# EAGLE schematic nano-addon-schematic (EAGLE 9.0.1)
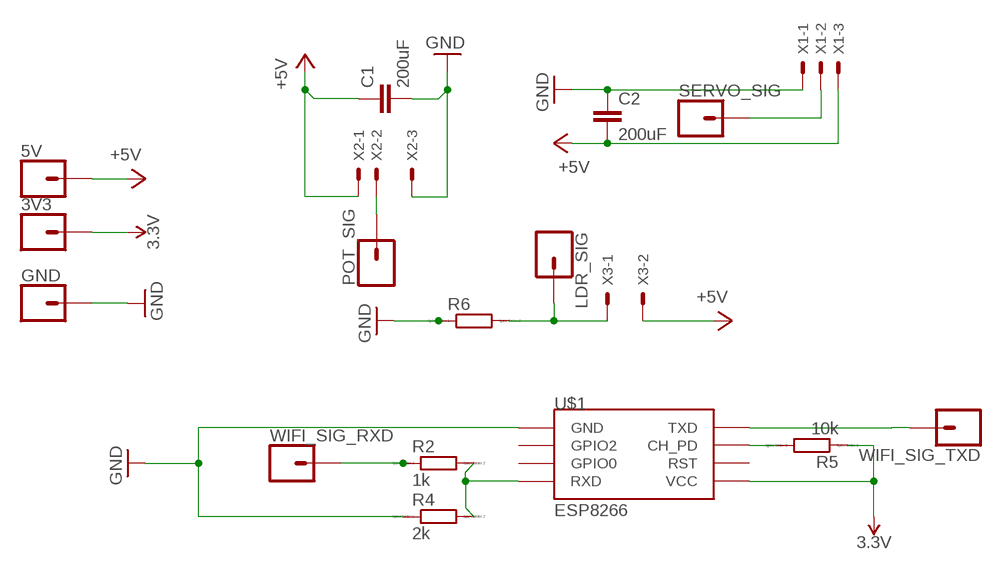
[diagram p0: schematic, sheet 1]

## Parts
3V3  CONN_01  [1X01]
5V  CONN_01  [1X01]
C1  200uF  C-EU050-030X075  [C050-030X075]
C2  200uF  C-EU050-030X075  [C050-030X075]
GND  CONN_01  [1X01]
LDR_SIG  CONN_01  [1X01]
POT_SIG  CONN_01  [1X01]
R2  1k  R0204/7  [0204/7]
R4  2k  R0204/7  [0204/7]
R5  10k  R0204/7  [0204/7]
R6  R0204/7  [0204/7]
SERVO_SIG  CONN_01  [1X01]
U$1  ESP8266  ESP01  [ESP01]
WIFI_SIG_RXD  CONN_01  [1X01]
WIFI_SIG_TXD  CONN_01  [1X01]
X1  KK-156-3  [KK-156-3]
X2  KK-156-3  [KK-156-3]
X3  KK-156-2  [KK-156-2]

## Nets
3.3V: 3V3.1 R5.1 U$1.VCC
+5V: 5V.1 C1.1 C2.2 X1.3 X2.1 X3.2
GND: C1.2 C2.1 GND.1 R4.1 R6.1 U$1.GND X1.1 X2.3
LDR_SIG: LDR_SIG.1 R6.2 X3.1
N$1: POT_SIG.1 X2.2
N$6: R5.2 U$1.CH_PD
N$8: R2.2 R4.2 U$1.RX(RXD)
SERVO_SIG: SERVO_SIG.1 X1.2
WIFI_SIG_RXD: R2.1 WIFI_SIG_RXD.1
WIFI_SIG_TXD: U$1.TX(TXD) WIFI_SIG_TXD.1
Unconnected: U$1.GPIO0 U$1.GPIO2 U$1.RST

## Library data of the parts
3V3 5V GND LDR_SIG POT_SIG SERVO_SIG WIFI_SIG_RXD WIFI_SIG_TXD = SparkFun-Connectors:CONN_01: Single connection point. Often used as Generic Header-pin footprint for 0.1 inch spaced/style header connections On any of the 0.1 inch spaced packages, you can populate with these: Break Away Headers - Straight <https://www.sparkfun.com/products/116> (PRT-00116) Break Away Male Headers - Right Angle <https://www.sparkfun.com/products/553> (PRT-00553) Female Headers <https://www.sparkfun.com/products/115> (PRT-00115) Break Away Headers - Machine Pin <https://www.sparkfun.com/products/117> (PRT-00117) Break Away Female Headers - Swiss Machine Pin <https://www.sparkfun.com/products/743> (PRT-00743) This device is also useful as a general connection point to wire up your design to another part of your project. Our various solder wires solder well into these plated through hole pads. Hook-Up Wire - Assortment (Stranded, 22 AWG) <https://www.sparkfun.com/products/11375> (PRT-11375) Hook-Up Wire - Assortment (Solid Core, 22 AWG) <https://www.sparkfun.com/products/11367> (PRT-11367) View the entire wire category on our website here <https://www.sparkfun.com/categories/141> Special notes: SMTSO-256-ET is a "flush mount" nut for a 4-40 screw. We mostly use this on specialty testbeds; it is a nice way to connect hardware to your PCB at an adjustable hieght. Also note, the SNAP packages are for using a snappable style connector. We sell a baggie of snaps and they are also used on two LilyPad designs: Snap Assortment - 30 pack (male and female) <https://www.sparkfun.com/products/11347> (DEV-11347) LilyPad Arduino SimpleSnap <https://www.sparkfun.com/products/10941> (DEV-10941) LilyPad SimpleSnap Protoboard <https://www.sparkfun.com/products/10940> (DEV-10940)
C1 C2 = resistor:C-EU: CAPACITOR, European symbol
R2 R4-R6 = eagle-ltspice:R: RESISTOR, European symbol; SPICEMODEL: NONE; SPICEPREFIX: R
U$1 = esp8266modules:ESP01: ESP8266 Wifi module 01
X1 X2 = con-molex:KK-156-3: KK 156 HEADER Source: http://www.molex.com/pdm_docs/sd/026604100_sd.pdf; MF: MOLEX; OC_FARNELL: unknown; OC_NEWARK: unknown
X3 = con-molex:KK-156-2: KK 156 HEADER Source: http://www.molex.com/pdm_docs/sd/026604100_sd.pdf; MF: MOLEX; OC_FARNELL: unknown; OC_NEWARK: unknown

## Net classes
0 default: width 0.152 mm, drill 0.3 mm, clearance 0.152 mm